# Altium schematic sheet UART.SchDoc
size A; SheetNumber: 7; SheetTotal: 9
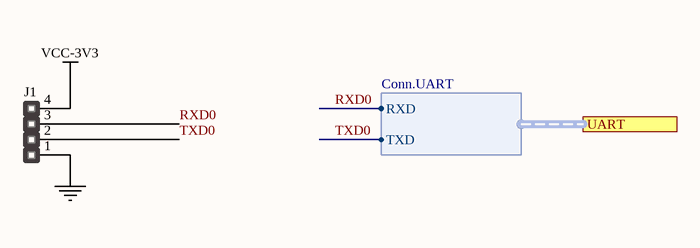
[diagram p0: UART.SchDoc]

## Parts
J1  HEADER_1x4  [HM1X4]  (value not drawn)

## Ports
UART (harness Conn.UART)

## Harnesses
Conn.UART: RXD, TXD

## Nets
GND: J1.1
VCC-3V3: J1.4
RXD0: J1.3 ; port UART.RXD
TXD0: J1.2 ; port UART.TXD